# EAGLE design TiltSensor (EAGLE 7.3.0)
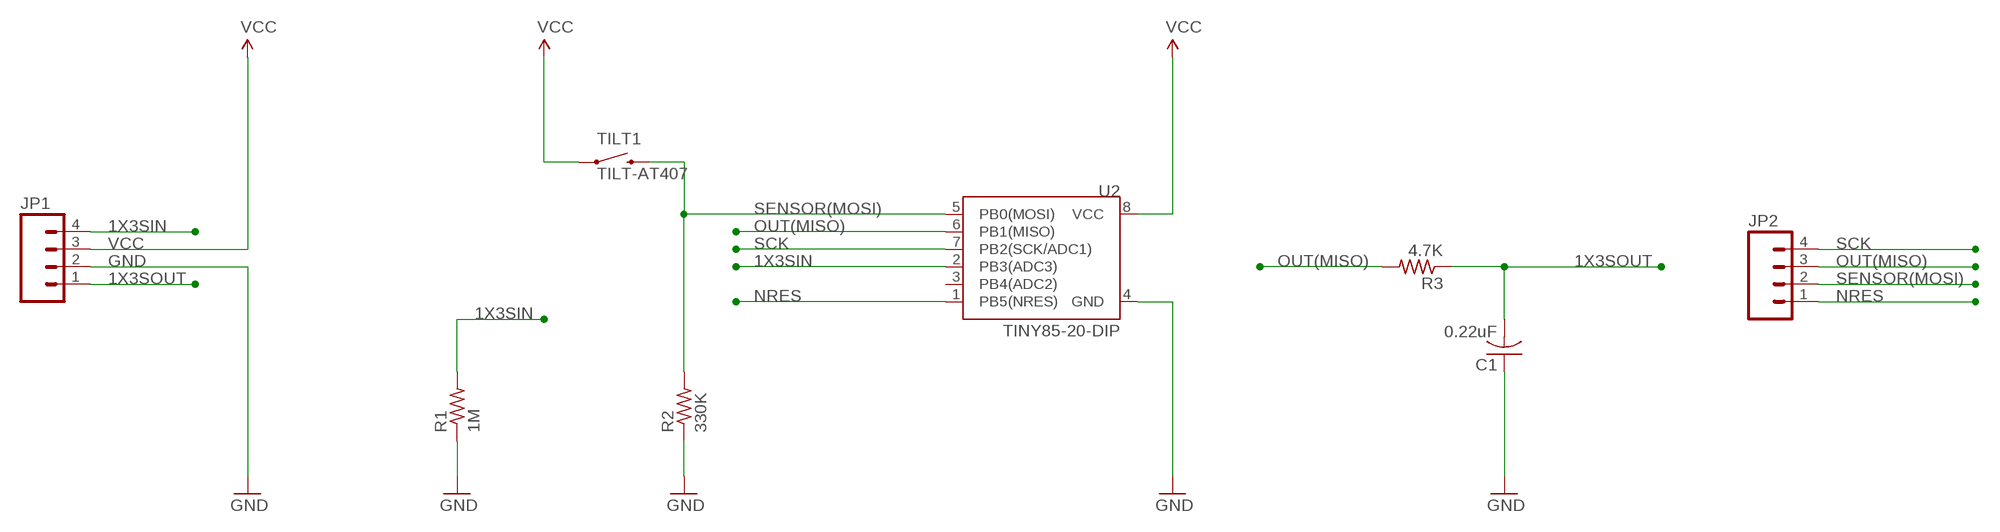
[diagram p0: schematic, sheet 1]

## Parts
C1  0.22uF  C-USC0402  [C0402]
JP1  M04PTH  [1X04]
JP2  M04PTH  [1X04]
R1  1M  R-US_R0603  [R0603]
R2  330K  R-US_R0603  [R0603]
R3  4.7K  R-US_R0603  [R0603]
TILT1  TILT-AT407  [TILT-AT407]
U2  TINY85-20-DIP  ATTINY45TINY85-20-DIP  [DIP08]

## Nets
1X3SIN: JP1.4 R1.2 U2.2(PB3(ADC3))
1X3SOUT: C1.2 JP1.1 R3.1
GND: C1.1 JP1.2 R1.1 R2.1 U2.4(GND)
NRES: JP2.1 U2.1(PB5(NRES))
OUT(MISO): JP2.3 R3.2 U2.6(PB1(MISO))
SCK: JP2.4 U2.7(PB2(SCK/ADC1))
SENSOR(MOSI): JP2.2 R2.2 TILT1.P$2 U2.5(PB0(MOSI))
VCC: JP1.3 TILT1.P$1 U2.8(VCC)
Unconnected: U2.3(PB4(ADC2))

## Library data of the parts
C1 = adafruit:C-US: CAPACITOR, American symbol
JP1 JP2 = SparkFun-Connectors:M04: Header 4 Standard 4-pin 0.1" header. Use with straight break away headers (SKU : PRT-00116), right angle break away headers (PRT-00553), swiss pins (PRT-00743), machine pins (PRT-00117), and female headers (PRT-00115). Molex polarized connector foot print use with SKU : PRT-08231 with associated crimp pins and housings. 1MM SMD Version SKU: PRT-10208
R1-R3 = adafruit:R-US_: RESISTOR, American symbol
TILT1 = SparkFun-Electromechanical:TILT-AT407
U2 = SparkFun-DigitalIC:ATTINY45: Atmel 8-pin 2/4/8kB flash uC; PROD_ID: IC-09445

## Board
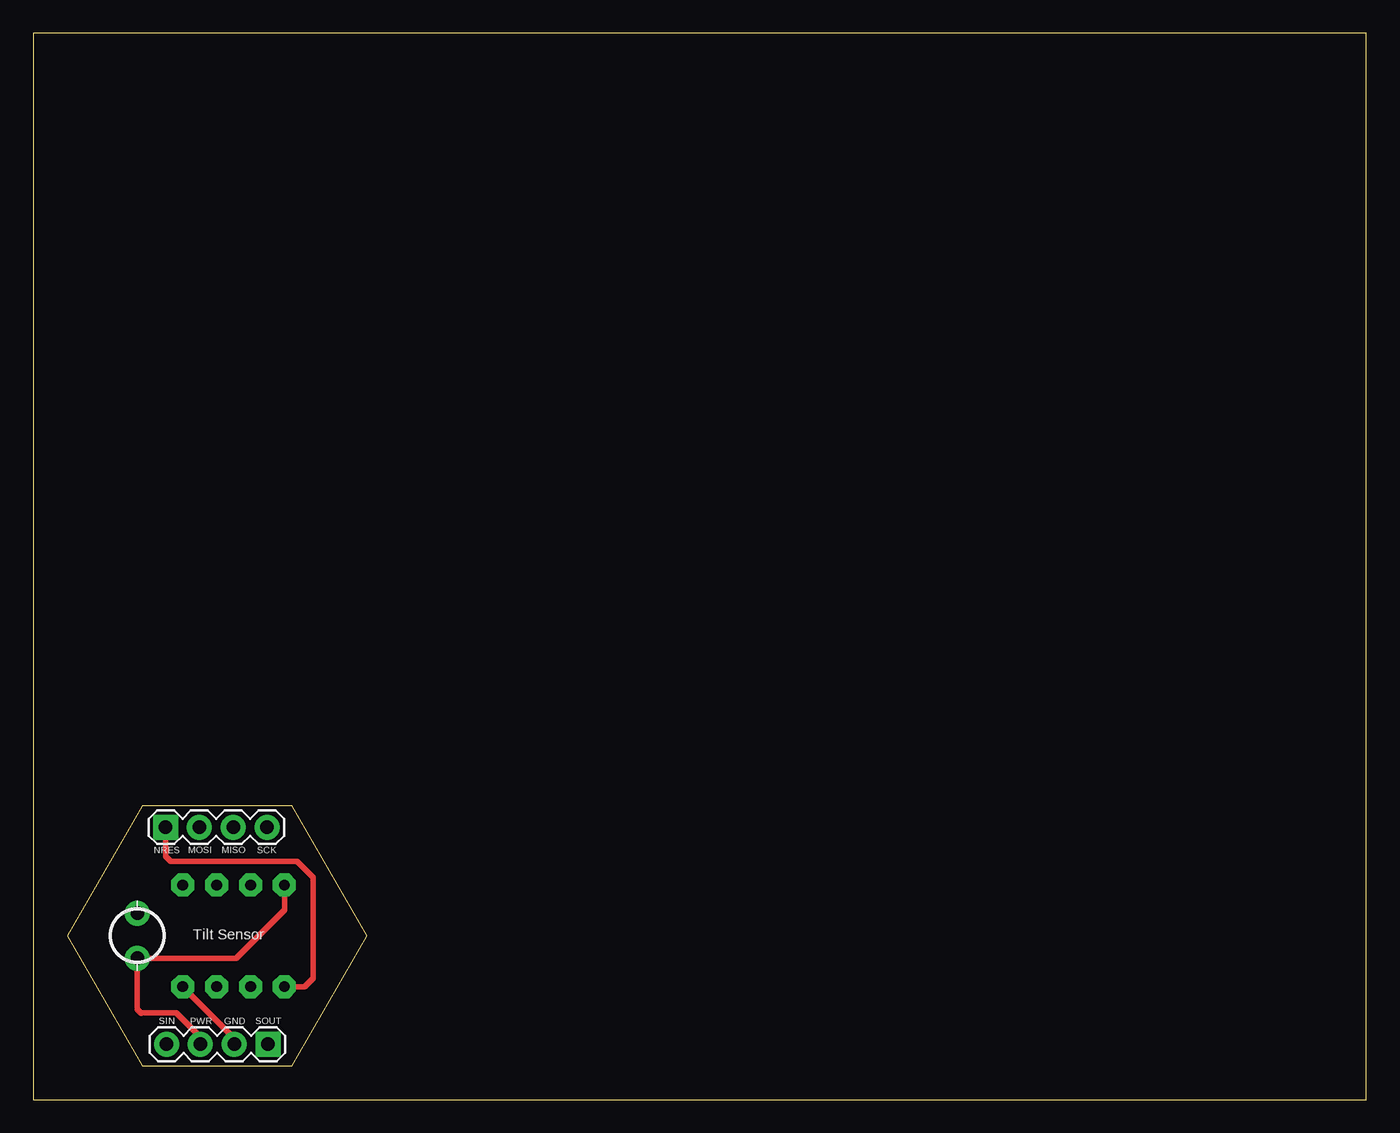
[diagram p1: board, top side]
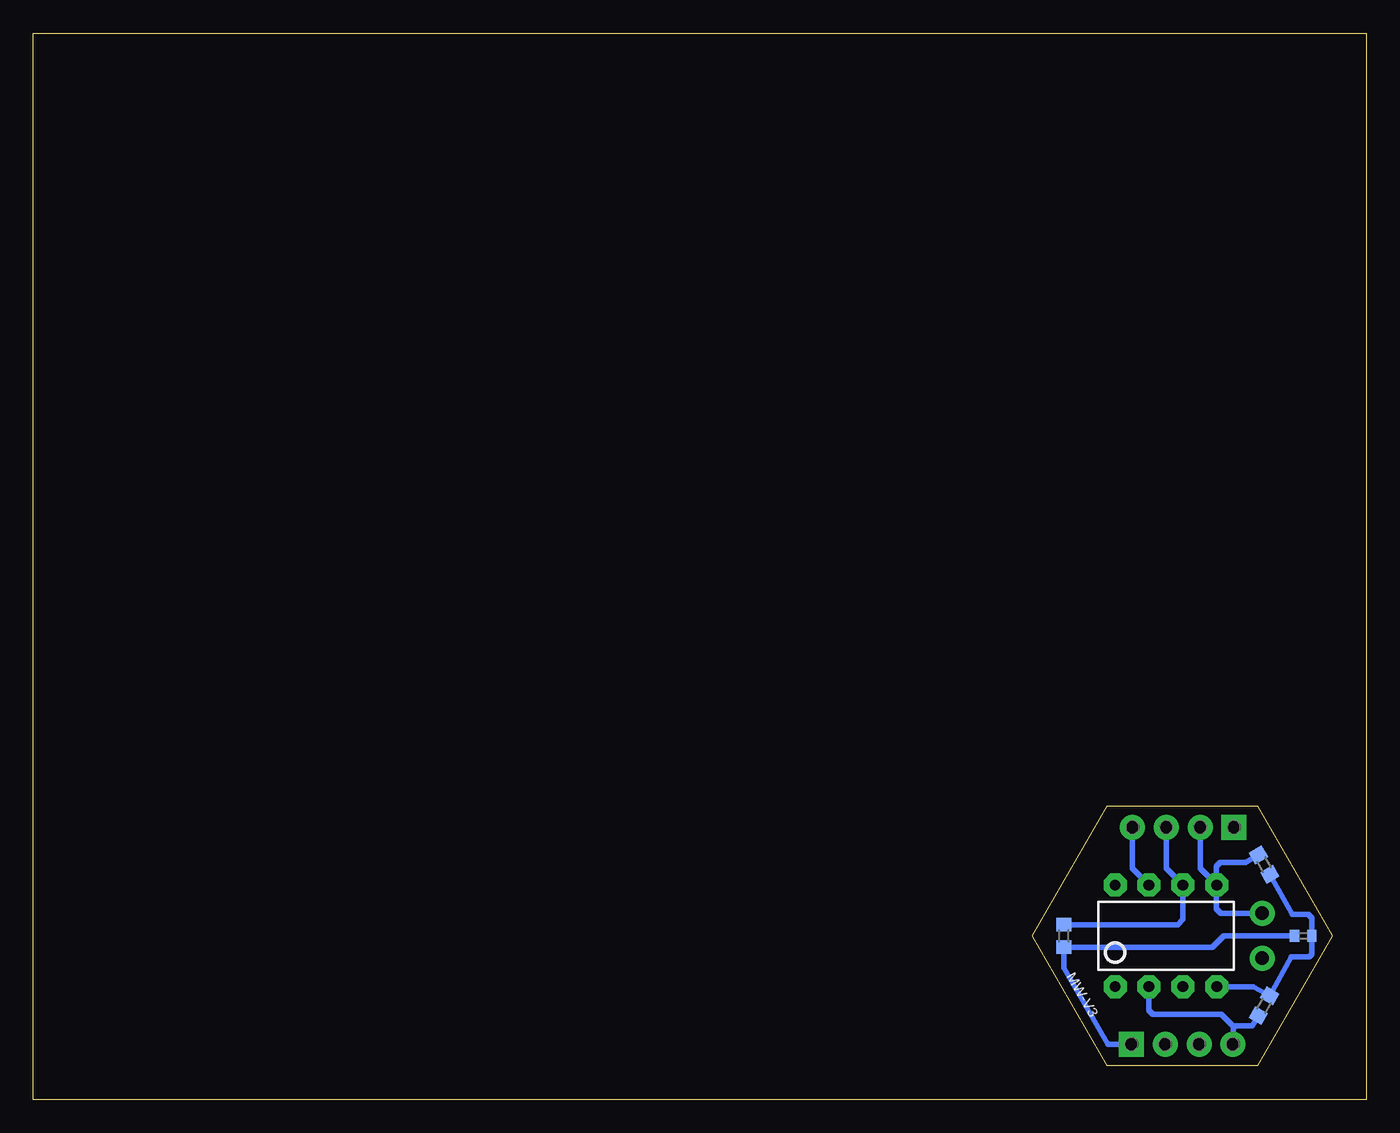
[diagram p2: board, bottom side, seen from below]

Size 100 x 80 mm. Coordinates in mm from the lower left corner, seen from the top.
Outline: 0,0 100,0 100,80 0,80 0,0
Outline: 8.16,2.55 19.41,2.55 25.03,12.29 19.41,22.03 8.16,22.03 2.53,12.29 8.16,2.55
Copper layers (1*16): Top 0.035mm / dielectric 1.5mm / Bottom 0.035mm
Design rules "default": minimum track width 10mil, minimum drill 24mil, track to track 8mil, track to pad 8mil, pad to pad 8mil, via to via 8mil, smd to smd 8mil, copper to edge 40mil, drill to drill 8mil, minimum pad ring 10mil, minimum via ring 8mil, stop-mask expansion 4mil, vias tented up to drill 0mil, thermal gap 10mil

### Footprints (pad centres in the part's own frame; a part is rotated, then mirrored left to right if it is on the bottom)
C0402 = smd 0.7 x 0.9: 1 -0.65,0; 2 0.65,0
1X04 = drill 1.016 pad 1.88 square: 1 0,0 | drill 1.016 pad 1.88: 2 2.54,0; 3 5.08,0; 4 7.62,0
R0603 = smd 1 x 1.1: 1 -0.85,0; 2 0.85,0
TILT-AT407 = drill 1.016 pad 1.88: P$1 -1.69,0; P$2 1.69,0
DIP08 = drill 0.813 pad 1.727 octagon: 1 -3.81,-3.81; 2 -1.27,-3.81; 3 1.27,-3.81; 4 3.81,-3.81; 5 3.81,3.81; 6 1.27,3.81; 7 -1.27,3.81; 8 -3.81,3.81

### Placement (x,y rotation side)
C1  4.74,12.28 180 bottom
JP1  17.61,4.15 180 top
JP2  9.92,20.43 0 top
R1  7.67,7.04 240 bottom
R2  7.66,17.63 120 bottom
R3  22.68,12.28 90 bottom
TILT1  7.8,12.29 90 top
U2  15.02,12.28 0 bottom

### Tracks (layer width: path | path; a pad name or v marks a point on that pad's centre or on a via)
1X3SIN
  Bottom 0.4: R1.2 8.53,5.54 9.75,5.54 9.89,5.4 | 9.89,5.4 9.98,5.31 9.98,4.17 JP1.4 | U2.2 16.29,6.69 15.99,6.39 10.87,6.39 9.89,5.4
1X3SOUT
  Bottom 0.4: C1.2 5.4,12.29 10.68,12.29 11.54,11.43 R3.1 22.68,9.88 22.7,9.87 19.38,4.15 JP1.1
GND
  Top 0.4: JP1.2 15.07,4.61 U2.4
  Bottom 0.4: R2.1 5.55,13.88 4.33,13.88 4.09,13.64 C1.1 4.09,10.89 4.28,10.69 5.6,10.69 R1.1 8.46,8.47 U2.4
NRES
  Top 0.4: JP2.1 9.92,18.25 10.3,17.87 19.79,17.87 20.99,16.66 20.99,9.09 20.37,8.47 U2.1
OUT(MISO)
  Bottom 0.4: JP2.3 15,17.34 U2.6 13.75,13.5 14.15,13.11 22.66,13.11 R3.2
SCK
  Bottom 0.4: JP2.4 17.54,17.34 U2.7
SENSOR(MOSI)
  Bottom 0.4: JP2.2 12.46,17.34 U2.5 | TILT1.P$2 10.92,13.98 11.24,14.3 11.24,16.07 U2.5 | R2.2 9.04,17.79 10.95,17.79 11.24,17.5 11.24,16.12 U2.5
VCC
  Top 0.4: JP1.3 12.54,4.7 10.73,6.5 8.13,6.5 8.1,6.48 7.8,6.78 TILT1.P$1 15.23,10.6 18.87,14.25 18.87,16.05 U2.8

### Text on the board
tPlace: NRES | MOSI | MISO | SCK | Tilt Sensor | SIN | PWR | GND | SOUT
bPlace: MW-V3